# EAGLE schematic DisplayController (EAGLE 9.2.2)
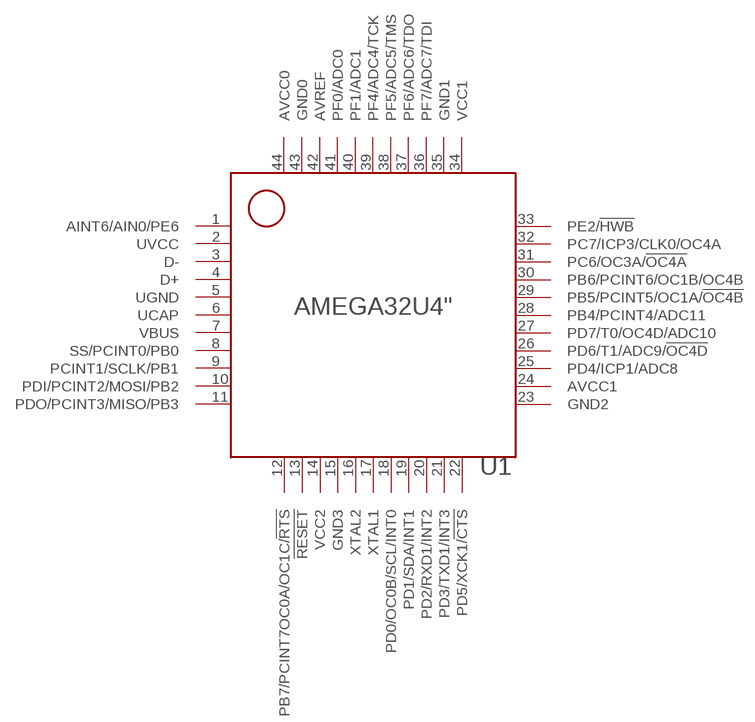
[diagram p0: schematic, sheet 1]

## Parts
U1  AMEGA32U4"  [TQFP44]
Unconnected: U1.1(AINT6/AIN0/PE6) U1.2(UVCC) U1.3(D-) U1.4(D+) U1.5(UGND) U1.6(UCAP) U1.7(VBUS) U1.8(SS/PCINT0/PB0) U1.9(PCINT1/SCLK/PB1) U1.10(PDI/PCINT2/MOSI/PB2) U1.11(PDO/PCINT3/MISO/PB3) U1.12(PB7/PCINT7OC0A/OC1C/!RTS) U1.13(!RESET) U1.14(VCC2) U1.15(GND3) U1.16(XTAL2) U1.17(XTAL1) U1.18(PD0/OC0B/SCL/INT0) U1.19(PD1/SDA/INT1) U1.20(PD2/RXD1/INT2) U1.21(PD3/TXD1/INT3) U1.22(PD5/XCK1/!CTS) U1.23(GND2) U1.24(AVCC1) U1.25(PD4/ICP1/ADC8) U1.26(PD6/T1/ADC9/!OC4D) U1.27(PD7/T0/OC4D/ADC10) U1.28(PB4/PCINT4/ADC11) U1.29(PB5/PCINT5/OC1A/!OC4B) U1.30(PB6/PCINT6/OC1B/OC4B) U1.31(PC6/OC3A/!OC4A) U1.32(PC7/ICP3/CLK0/OC4A) U1.33(PE2/!HWB) U1.34(VCC1) U1.35(GND1) U1.36(PF7/ADC7/TDI) U1.37(PF6/ADC6/TDO) U1.38(PF5/ADC5/TMS) U1.39(PF4/ADC4/TCK) U1.40(PF1/ADC1) U1.41(PF0/ADC0) U1.42(AVREF) U1.43(GND0) U1.44(AVCC0)

## Library data of the parts
U1 = NixieDisplay:AMEGA32U4: 8 bit 16Mhz uC with USB